# EAGLE design Attiny programmer shield (EAGLE 7.3.0)
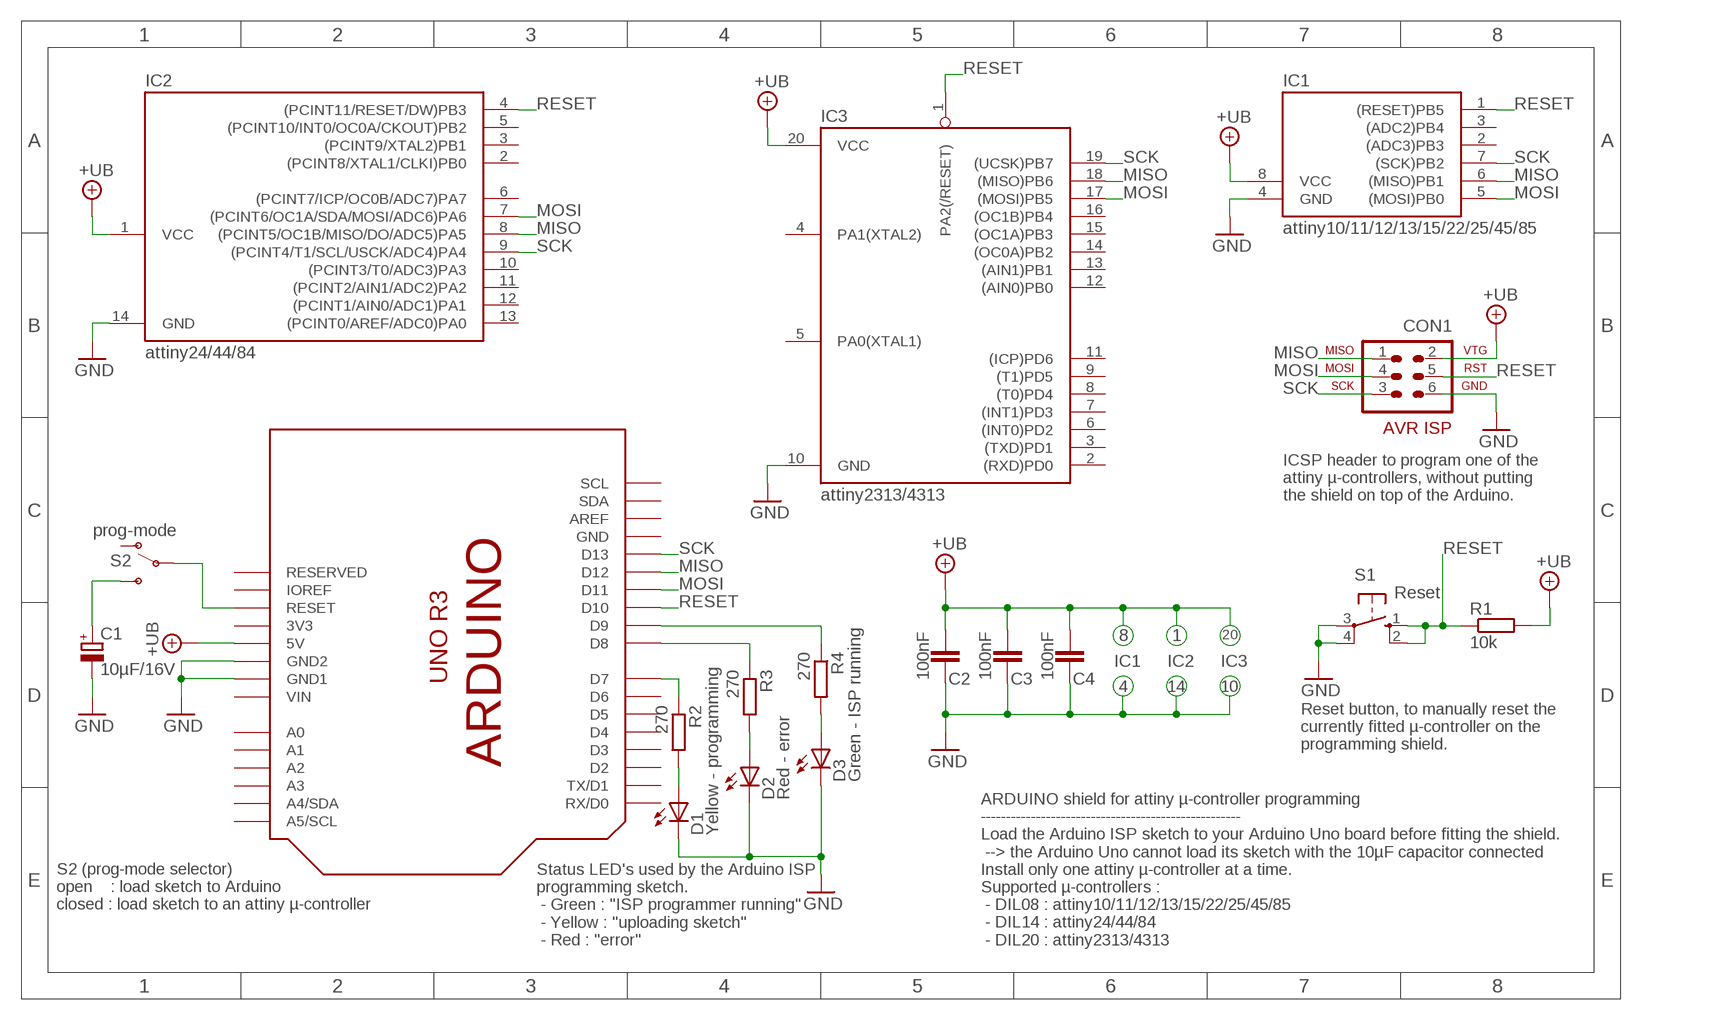
[diagram p0: schematic, sheet 1]

## Parts
C1  10µF/16V  CPOL-EUE2,5-6E  [E2,5-6E]
C2  100nF  C-EU050-025X075  [C050-025X075]
C3  100nF  C-EU050-025X075  [C050-025X075]
C4  100nF  C-EU050-025X075  [C050-025X075]
CON1  ICSP  AVR-ISP-6  [AVR-ISP-6]
D1  Yellow - programming  LED3MM  [LED3MM]
D2  Red - error  LED3MM  [LED3MM]
D3  Green - ISP running  LED3MM  [LED3MM]
IC1  attiny10/11/12/13/15/22/25/45/85  TINY138P3  [DIL08]
IC2  attiny24/44/84  TINY24/44/84-PU  [DIL14]
IC3  attiny2313/4313  ATTINY4313-*P*  [DIL20]
R1  10k  R-EU_0207/7  [0207/7]
R2  270  R-EU_0204/5  [0204/5]
R3  270  R-EU_0204/5  [0204/5]
R4  270  R-EU_0204/5  [0204/5]
S1  Reset  10-XX  [B3F-10XX]
S2  prog-mode  SWITCH-SPDT_9.0X4.0MM  [MINI_SPDT_SWITCH-9.0X4.0MM]
U$1  Arduino Uno  ARDUINO-UNO_R3  [ARDUINO-R3]

## Nets
+UB: C2.2 C3.2 C4.2 CON1.2 IC1.8(VCC) IC2.1(VCC) IC3.20(VCC) R1.2 U$1.5V
GND: C1.- C2.1 C3.1 C4.1 CON1.6 D1.K(C) D2.K(C) D3.K(C) IC1.4(GND) IC2.14(GND) IC3.10(GND) S1.3(P) S1.4(P1) U$1.GND1 U$1.GND2
MISO: CON1.1 IC1.6((MISO)PB1) IC2.8((PCINT5/OC1B/MISO/DO/ADC5)PA5) IC3.18((MISO)PB6) U$1.D12
MOSI: CON1.4 IC1.5((MOSI)PB0) IC2.7((PCINT6/OC1A/SDA/MOSI/ADC6)PA6) IC3.17((MOSI)PB5) U$1.D11
N$1: C1.+ S2.3(S)
N$2: R4.1 U$1.D9
N$3: R2.1 U$1.D7
N$4: R3.1 U$1.D8
N$5: D1.A R2.2
N$6: D2.A R3.2
N$7: D3.A R4.2
N$19: S2.2(P) U$1.RESET
RESET: CON1.5 IC1.1((RESET)PB5) IC2.4((PCINT11/RESET/DW)PB3) IC3.1(PA2(/RESET)) R1.1 S1.1(S) S1.2(S1) U$1.D10
SCK: CON1.3 IC1.7((SCK)PB2) IC2.9((PCINT4/T1/SCL/USCK/ADC4)PA4) IC3.19((UCSK)PB7) U$1.D13
Unconnected: IC1.2((ADC3)PB3) IC1.3((ADC2)PB4) IC2.2((PCINT8/XTAL1/CLKI)PB0) IC2.3((PCINT9/XTAL2)PB1) IC2.5((PCINT10/INT0/OC0A/CKOUT)PB2) IC2.6((PCINT7/ICP/OC0B/ADC7)PA7) IC2.10((PCINT3/T0/ADC3)PA3) IC2.11((PCINT2/AIN1/ADC2)PA2) IC2.12((PCINT1/AIN0/ADC1)PA1) IC2.13((PCINT0/AREF/ADC0)PA0) IC3.2((RXD)PD0) IC3.3((TXD)PD1) IC3.4(PA1(XTAL2)) IC3.5(PA0(XTAL1)) IC3.6((INT0)PD2) IC3.7((INT1)PD3) IC3.8((T0)PD4) IC3.9((T1)PD5) IC3.11((ICP)PD6) IC3.12((AIN0)PB0) IC3.13((AIN1)PB1) IC3.14((OC0A)PB2) IC3.15((OC1A)PB3) IC3.16((OC1B)PB4) S2.1(O) U$1.A0 U$1.A1 U$1.A2 U$1.A3 U$1.A4(A4/SDA) U$1.A5(A5/SCL) U$1.AREF U$1.D0(RX/D0) U$1.D1(TX/D1) U$1.D2 U$1.D3 U$1.D4 U$1.D5 U$1.D6 U$1.IOREF U$1.RESERVED U$1.SCL U$1.SDA

## Notes on the sheet
- ICSP header to program one of the 
  attiny µ-controllers, without putting 
  the shield on top of the Arduino.
- 8 | 1 | 20
- IC1 | IC2 | IC3
- 4 | 14 | 10
- Reset button, to manually reset the
  currently fitted µ-controller on the
  programming shield.
- S2 (prog-mode selector)
  open    : load sketch to Arduino
  closed : load sketch to an attiny µ-controller
- Status LED's used by the Arduino ISP 
  programming sketch.
   - Green : "ISP programmer running"
   - Yellow : "uploading sketch"
   - Red : "error"
- ARDUINO shield for attiny µ-controller programming
  ----------------------------------------------------
  Load the Arduino ISP sketch to your Arduino Uno board before fitting the shield.
   --> the Arduino Uno cannot load its sketch with the 10µF capacitor connected
  Install only one attiny µ-controller at a time.
  Supported µ-controllers : 
   - DIL08 : attiny10/11/12/13/15/22/25/45/85
   - DIL14 : attiny24/44/84
   - DIL20 : attiny2313/4313

## Power pins joined to a net without a drawn wire
3V3: U$1.3V(3V3)
GND: U$1.GND
VIN: U$1.VIN

## Library data of the parts
C1 = rcl:CPOL-EU: POLARIZED CAPACITOR, European symbol
C2-C4 = rcl:C-EU: CAPACITOR, European symbol
CON1 = avr-4:AVR-ISP-6: AVR ISP-6 Serial Programming Header
D1-D3 = led:LED: LED OSRAM: - CHIPLED LG R971, LG N971, LY N971, LG Q971, LY Q971, LO R971, LY R971 LH N974, LH R974 LS Q976, LO Q976, LY Q976 LO Q996 - Hyper CHIPLED LW Q18S LB Q993, LB Q99A, LB R99A - SideLED LS A670, LO A670, LY A670, LG A670, LP A670 LB A673, LV A673, LT A673, LW A673 LH A674 LY A675 LS A676, LA A676, LO A676, LY A676, LW A676 LS A679, LY A679, LG A679 - Hyper Micro SIDELED® LS Y876, LA Y876, LO Y876, LY Y876 LT Y87S - SmartLED LW L88C, LW L88S LB L89C, LB L89S, LG L890 LS L89K, LO L89K, LY L89K LS L896, LA L896, LO L896, LY L896 - TOPLED LS T670, LO T670, LY T670, LG T670, LP T670 LSG T670, LSP T670, LSY T670, LOP T670, LYG T670 LG T671, LOG T671, LSG T671 LB T673, LV T673, LT T673, LW T673 LH T674 LS T676, LA T676, LO T676, LY T676, LB T676, LH T676, LSB T676, LW T676 LB T67C, LV T67C, LT T67C, LS T67K, LO T67K, LY T67K, LW E67C LS E67B, LA E67B, LO E67B, LY E67B, LB E67C, LV E67C, LT E67C LW T67C LS T679, LY T679, LG T679 LS T770, LO T770, LY T770, LG T770, LP T770 LB T773, LV T773, LT T773, LW T773 LH T774 LS E675, LA E675, LY E675, LS T675 LS T776, LA T776, LO T776, LY T776, LB T776 LHGB T686 LT T68C, LB T68C - Hyper Mini TOPLED® LB M676 - Mini TOPLED Santana® LG M470 LS M47K, LO M47K, LY M47K Source: http://www.osram.convergy.de LUXEON: - LUMILED® LXK2-PW12-R00, LXK2-PW12-S00, LXK2-PW14-U00, LXK2-PW14-V00 LXK2-PM12-R00, LXK2-PM12-S00, LXK2-PM14-U00 LXK2-PE12-Q00, LXK2-PE12-R00, LXK2-PE12-S00, LXK2-PE14-T00, LXK2-PE14-U00 LXK2-PB12-K00, LXK2-PB12-L00, LXK2-PB12-M00, LXK2-PB14-N00, LXK2-PB14-P00, LXK2-PB14-Q00 LXK2-PR12-L00, LXK2-PR12-M00, LXK2-PR14-Q00, LXK2-PR14-R00 LXK2-PD12-Q00, LXK2-PD12-R00, LXK2-PD12-S00 LXK2-PH12-R00, LXK2-PH12-S00 LXK2-PL12-P00, LXK2-PL12-Q00, LXK2-PL12-R00 Source: www.luxeon.com KINGBRIGHT: KA-3528ASYC Source: www.kingbright.com
IC1 = avr-7:TINY13*
IC2 = avr-4:TINY24/44/84
IC3 = ccr-lib:ATTINY4313: Atmel Tiny4313 4K Flash, 128 bytes EEPROM, 128 bytes RAM
R1-R4 = resistor:R-EU_: RESISTOR, European symbol
S1 = switch-omron:10-XX: OMRON SWITCH; MPN: B3F-1000; OC_FARNELL: 176432; OC_NEWARK: 36M3542
S2 = ccr-lib:SWITCH-SPDT: Single-Pole, Double-Throw (SPDT) mini Switch
U$1 = ccr-lib:ARDUINO-UNO: Arduino R3 with extra pins : - IOref pin - reserved pin - duplicated I2C, A4/A5 pins

## Board
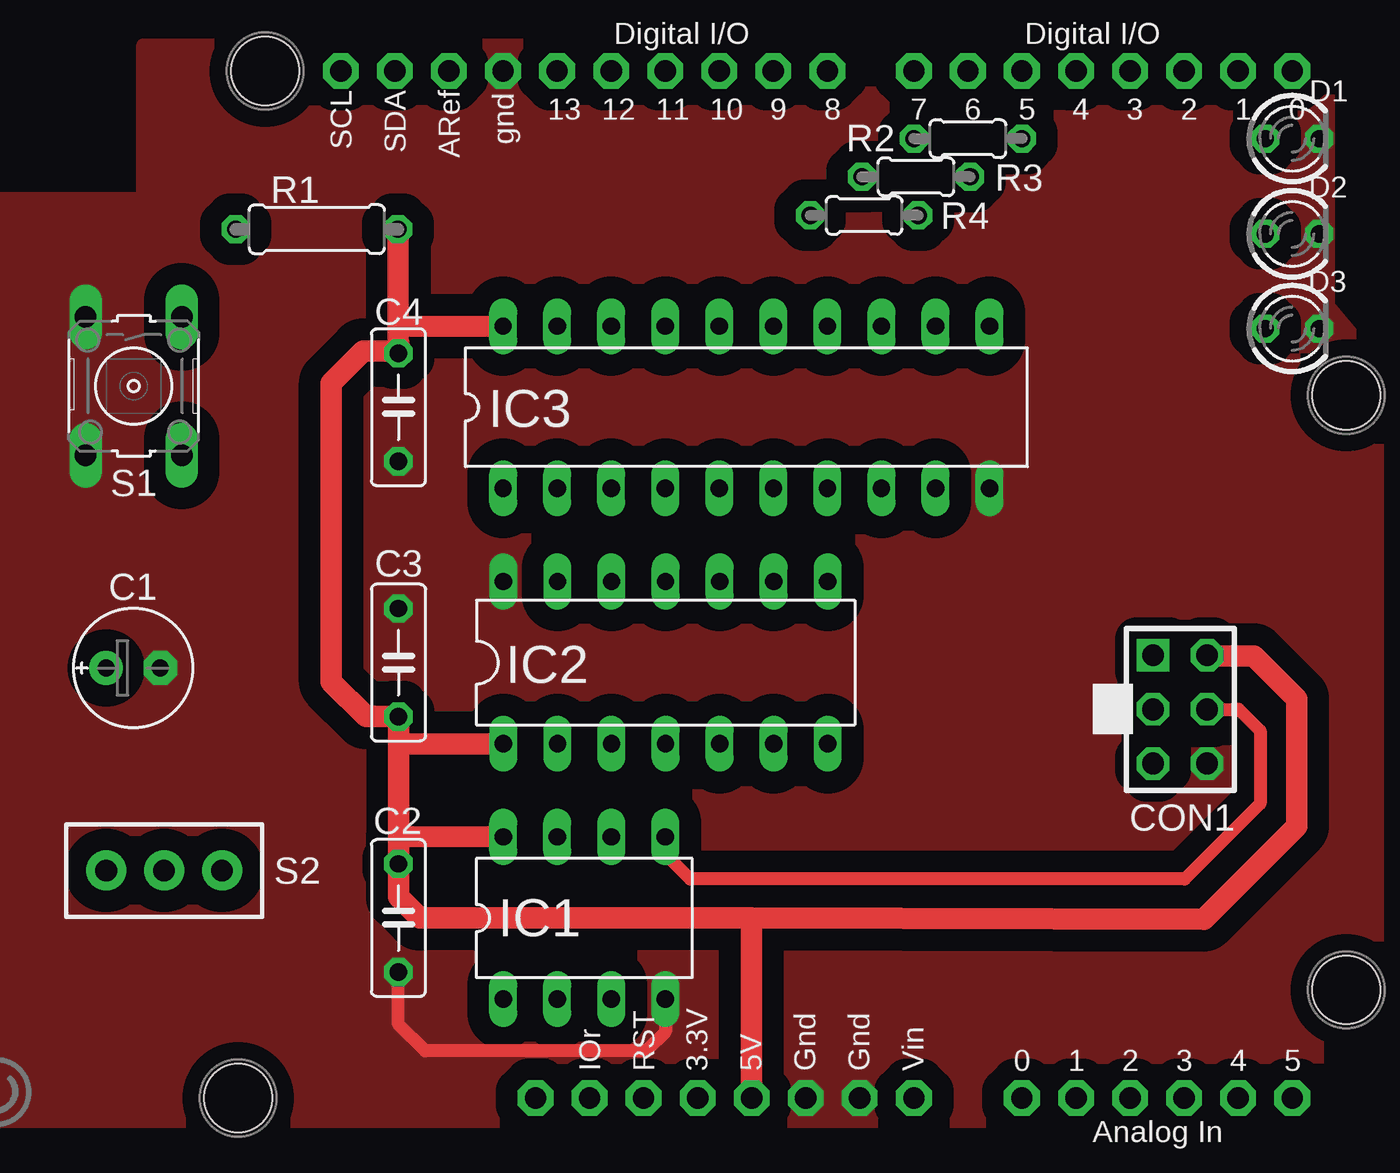
[diagram p1: board, top side]
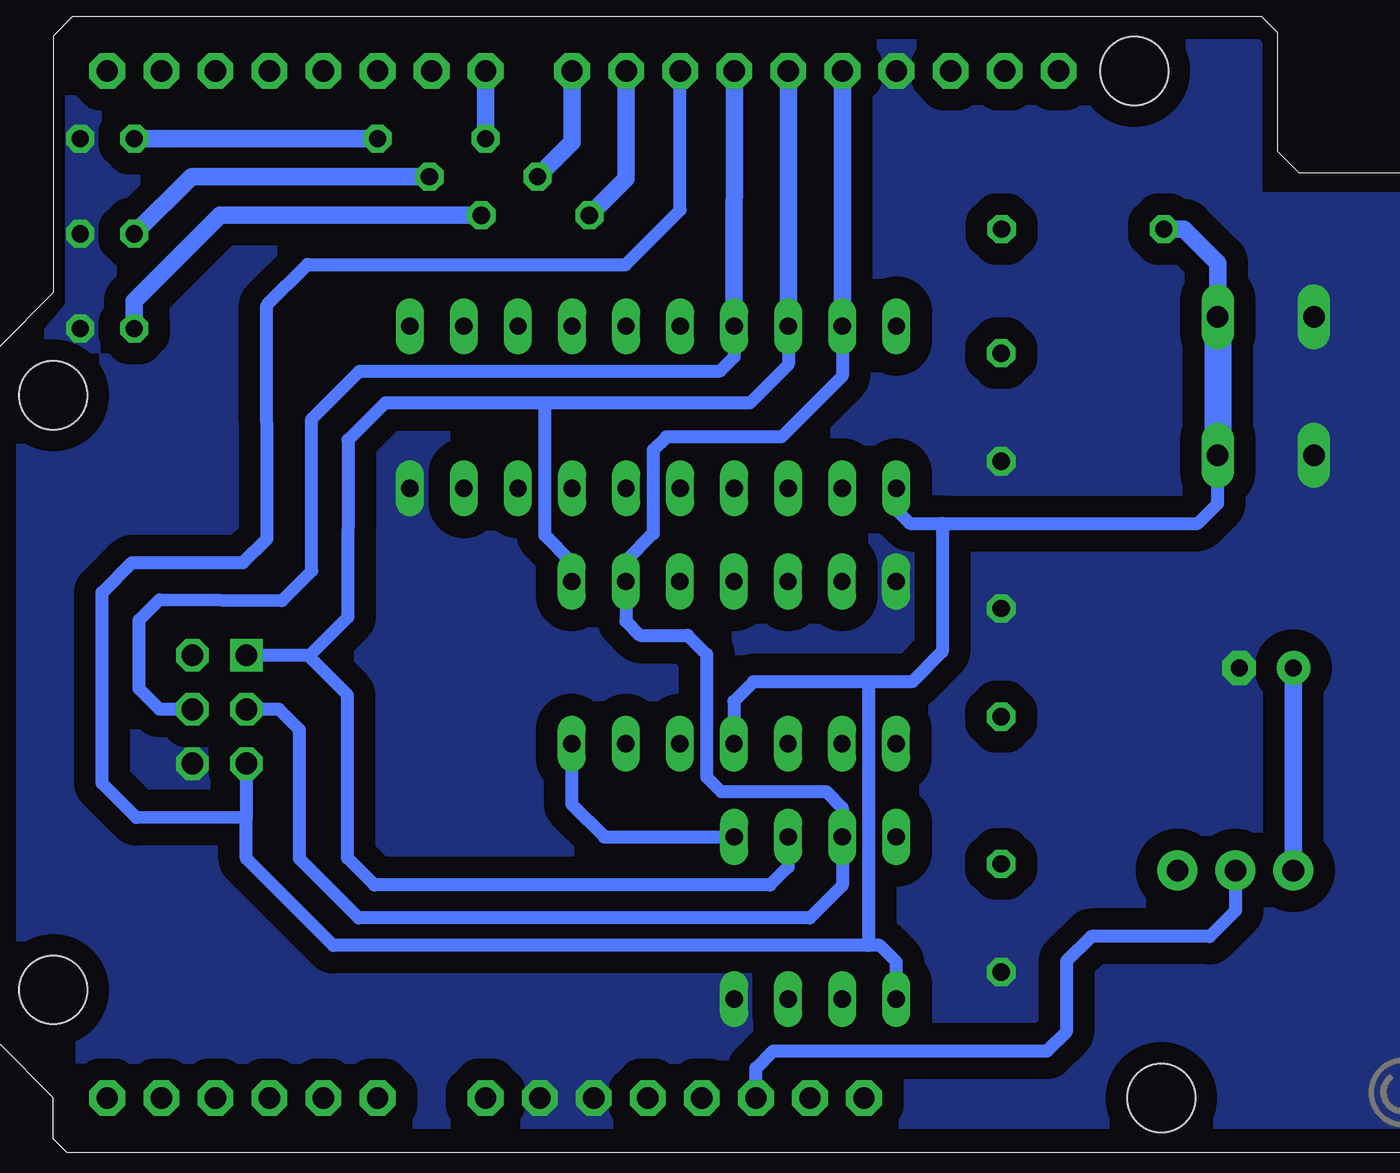
[diagram p2: board, bottom side, seen from below]

No outline drawn. Coordinates in mm, seen from the top.
Copper layers (1*16): Top 0.035mm / dielectric 1.5mm / Bottom 0.035mm
Design rules "ccc - AllPCB(prototyping)": minimum track width 16mil, minimum drill 0.4mm, track to track 6mil, track to pad 6mil, pad to pad 6mil, via to via 6mil, smd to smd 6mil, copper to edge 40mil, drill to drill 8mil, minimum pad ring 10mil, minimum via ring 8mil, stop-mask expansion 4mil, vias tented up to drill 0mil, thermal gap 10mil

### Footprints (pad centres in the part's own frame; a part is rotated, then mirrored left to right if it is on the bottom)
E2,5-6E = drill 0.813 pad 1.575: + -1.27,0 | drill 0.813 pad 1.575 octagon: - 1.27,0
C050-025X075 = drill 0.813 octagon: 1 -2.54,0; 2 2.54,0
AVR-ISP-6 = drill 1.016 square: 1 -2.54,-1.27 | drill 1.016 octagon: 2 -2.54,1.27; 3 0,-1.27; 4 0,1.27; 5 2.54,-1.27; 6 2.54,1.27
LED3MM = drill 0.813 octagon: A -1.27,0; K 1.27,0
DIL08 = drill 0.813 long: 1 -3.81,-3.81; 2 -1.27,-3.81; 3 1.27,-3.81; 4 3.81,-3.81; 5 3.81,3.81; 6 1.27,3.81; 7 -1.27,3.81; 8 -3.81,3.81
DIL14 = drill 0.813 long: 1 -7.62,-3.81; 2 -5.08,-3.81; 3 -2.54,-3.81; 4 0,-3.81; 5 2.54,-3.81; 6 5.08,-3.81; 7 7.62,-3.81; 8 7.62,3.81; 9 5.08,3.81; 10 2.54,3.81; 11 0,3.81; 12 -2.54,3.81; 13 -5.08,3.81; 14 -7.62,3.81
DIL20 = drill 0.813 long: 1 -11.43,-3.81; 2 -8.89,-3.81; 3 -6.35,-3.81; 4 -3.81,-3.81; 5 -1.27,-3.81; 6 1.27,-3.81; 7 3.81,-3.81; 8 6.35,-3.81; 9 8.89,-3.81; 10 11.43,-3.81; 11 11.43,3.81; 12 8.89,3.81; 13 6.35,3.81; 14 3.81,3.81; 15 1.27,3.81; 16 -1.27,3.81; 17 -3.81,3.81; 18 -6.35,3.81; 19 -8.89,3.81; 20 -11.43,3.81
0207/7 = drill 0.813 octagon: 1 -3.81,0; 2 3.81,0
0204/5 = drill 0.813 octagon: 1 -2.54,0; 2 2.54,0
B3F-10XX = drill 1.016 long: 1 -3.251,2.261; 2 3.251,2.261; 3 -3.251,-2.261; 4 3.251,-2.261
MINI_SPDT_SWITCH-9.0X4.0MM = drill 1.016 pad 1.88: 1 2.718,0; 2 0,0; 3 -2.718,0
ARDUINO-R3 = drill 1 pad 1.676 octagon: 3V 35.56,2.54; 5V 38.1,2.54; A0 50.8,2.54; A1 53.34,2.54; A2 55.88,2.54; A3 58.42,2.54; A4 60.96,2.54; A5 63.5,2.54; AREF 23.876,50.8; D0 63.5,50.8; D1 60.96,50.8; D2 58.42,50.8; D3 55.88,50.8; D4 53.34,50.8; D5 50.8,50.8; D6 48.26,50.8; D7 45.72,50.8; D8 41.656,50.8; D9 39.116,50.8; D10 36.576,50.8; D11 34.036,50.8; D12 31.496,50.8; D13 28.956,50.8; GND 26.416,50.8; GND1 43.18,2.54; GND2 40.64,2.54; IOREF 30.48,2.54; RESERVED 27.94,2.54; RESET 33.02,2.54; SCL 18.796,50.8; SDA 21.336,50.8; VIN 45.72,2.54 | hole 3.2: 15.24,50.8; 66.04,7.62; 13.97,2.54; 66.04,35.56

### Placement (x,y rotation side)
C1  9.04,22.75 0 top
C2  21.5,11 90 top
C3  21.5,23 270 top
C4  21.5,35 90 top
CON1  58.23,20.8 270 top
D1  63.5,47.62 0 top
D2  63.5,43.15 0 top
D3  63.5,38.7 0 top
IC1  30.23,11 0 top
IC2  34.05,23 0 top
IC3  37.85,35 0 top
R1  17.67,43.37 0 top
R2  48.26,47.62 0 top
R3  45.82,45.83 0 top
R4  43.38,44.02 0 top
S1  9.06,36 270 top
S2  10.49,13.23 0 top
U$1  0,0 0 top
U$2  [COPYRIGHT-LOGO-3-B]  2.6,2.79 270 top
U$3  [3X-LOGO-10-B]  51.21,27.19 0 top
U$4  [COPYRIGHT-LOGO-3-T]  2.63,2.82 90 top
U$5  [3X-LOGO-5-B]  3.35,2.3 0 top
U$6  [3X-LOGO-5-T]  6.38,2.3 0 top

### Tracks (layer width: path | path; a pad name or v marks a point on that pad's centre or on a via)
+UB
  Top 1.016: 21.5,19.19 C3.2 19.97,20.46 18.34,22.1 18.34,36.14 19.84,37.64 21.5,37.64 | 21.5,19.19 21.5,14.83 | 21.5,14.83 C2.2 21.5,11.99 22.49,11 38.09,11 | IC2.1 21.5,19.19 | R1.2 21.49,38.78 | 21.49,38.78 C4.2 | IC3.20 21.49,38.78 | IC1.8 21.5,14.83 | 38.09,11 59.33,10.95 63.7,15.3 63.7,21.3 61.68,23.32 59.5,23.32 CON1.2 | U$1.5V 38.09,11
  Top 1.27: 21.5,37.64 C4.2
GND
  Top 0.61: IC1.4 34.05,5.66 33.13,4.75 22.77,4.75 21.49,6.04 21.49,8.46 C2.1
  pour Bottom (isolate 1.016, no thermals): 64.7,6 64.7,1.4 1.25,1.4 1.25,44.8 9.5,44.8 9.5,52 65.2,52 65.2,39.75 67.5,37.01 67.5,6
  pour Top (isolate 1.016, no thermals): 64.69,6.03 64.69,1.43 1.24,1.43 1.24,44.83 9.49,44.83 9.49,52.03 65.19,52.03 65.19,39.78 67.49,37.03 67.49,6.03
MISO
  Bottom 0.61: IC1.6 31.5,13.4 32.36,12.55 50.94,12.55 52.21,13.82 52.21,21.48 54.07,23.34 CON1.1 | IC3.18 31.5,37.01 33.31,35.2 42.93,35.2 | 42.93,35.2 50.44,35.2 52.19,33.46 52.2,25.13 53.98,23.34 CON1.1 | 56.95,23.34 CON1.1 | IC2.8 41.67,27.72 42.94,28.98 42.93,35.2
  Bottom 0.813: U$1.D12 IC3.18
MOSI
  Top 0.61: CON1.4 60.98,20.8 61.99,19.8 61.99,16.38 58.44,12.83 35.21,12.83 34.02,14.01 34.02,14.81 IC1.5
  Bottom 0.61: IC3.17 34.04,37.37 34.7,36.7 51.64,36.69 53.89,34.45 53.89,27.31 55.28,25.92 61.03,25.96 62,25 62,21.76 61.04,20.8 CON1.4 | IC2.7 41.67,16.35 40.13,14.81 IC1.5
  Bottom 0.813: U$1.D11 IC3.17
N$1
  Bottom 0.813: C1.+ S2.3
N$2
  Bottom 0.813: U$1.D9 39.12,45.75 R4.1
N$3
  Bottom 0.813: U$1.D7 R2.1
N$4
  Bottom 0.813: U$1.D8 41.66,47.46 R3.1
N$5
  Bottom 0.813: R2.2 D1.A
N$6
  Bottom 0.813: R3.2 59.53,45.85 D2.A
N$7
  Bottom 0.813: R4.2 58.2,44.02 62.23,39.98 D3.A
N$19
  Bottom 0.61: U$1.RESET 33.02,3.94 32.21,4.75 19.32,4.75 18.44,5.63 18.42,8.98 17.26,10.13 11.7,10.13 10.49,11.35 S2.2
N$22  (via drill 1 pad 1.68)
  other vias: 21.34,50.8
N$23  (via drill 1 pad 1.68)
  other vias: 18.8,50.8
RESET
  Bottom 0.61: 56.96,15.72 62.13,15.71 63.74,17.32 63.74,26.3 62.35,27.7 57.12,27.7 55.99,28.82 56.01,39.79 54.09,41.71 39.16,41.7 36.58,44.27 U$1.D10 | IC2.4 34.05,21.18 33.14,22.1 27.74,22.1 | CON1.5 56.96,15.72 | IC3.1 26.42,30.17 25.79,29.54 24.26,29.54 | 24.26,29.54 12.26,29.54 11.32,30.47 S1.2 | 24.26,29.54 24.26,23.52 25.68,22.1 27.74,22.1 | IC1.1 26.43,8.93 27.2,9.7 27.74,9.7 | 27.74,22.1 27.74,9.7 | 27.74,9.7 52.88,9.7 56.96,13.79 56.96,15.72
  Bottom 0.813: R1.1 12.92,43.37 11.32,41.77 S1.1
  Bottom 1.27: S1.1 S1.2
SCK
  Bottom 0.61: IC3.19 28.96,36.47 31.82,33.6 37.23,33.6 37.85,32.99 37.85,29.06 39.14,27.76 IC2.9 39.13,24.95 38.46,24.28 36.23,24.28 35.33,23.38 35.33,17.62 34.66,16.94 29.71,16.94 28.96,16.18 IC1.7 28.96,12.52 30.49,11 51.68,11 54.47,13.78 54.47,19.84 55.43,20.8 CON1.3
  Bottom 0.813: U$1.D13 IC3.19

### Text on the board
tDocu: SCK | MISO | MOSI | RESET | uploading | 2017/001 V02 | Error! | RESET | ISPrunning | ATtiny2313 / ATtiny4313 | ATtiny programmer shield | ATtiny / 24/44/84 | In Circuit System / Programmer socket | mode | ATtiny10/11/12/13/15 / ATtiny22/25/45/85 | PROG-RUN | Carl
bDocu: 2017/001 V02 | Designed by the / Nostradomus Engineering Team | ATtiny programmer shield | Carl